# Altium schematic sheet main.schdoc
size A4; SheetNumber: 1; SheetTotal: 1
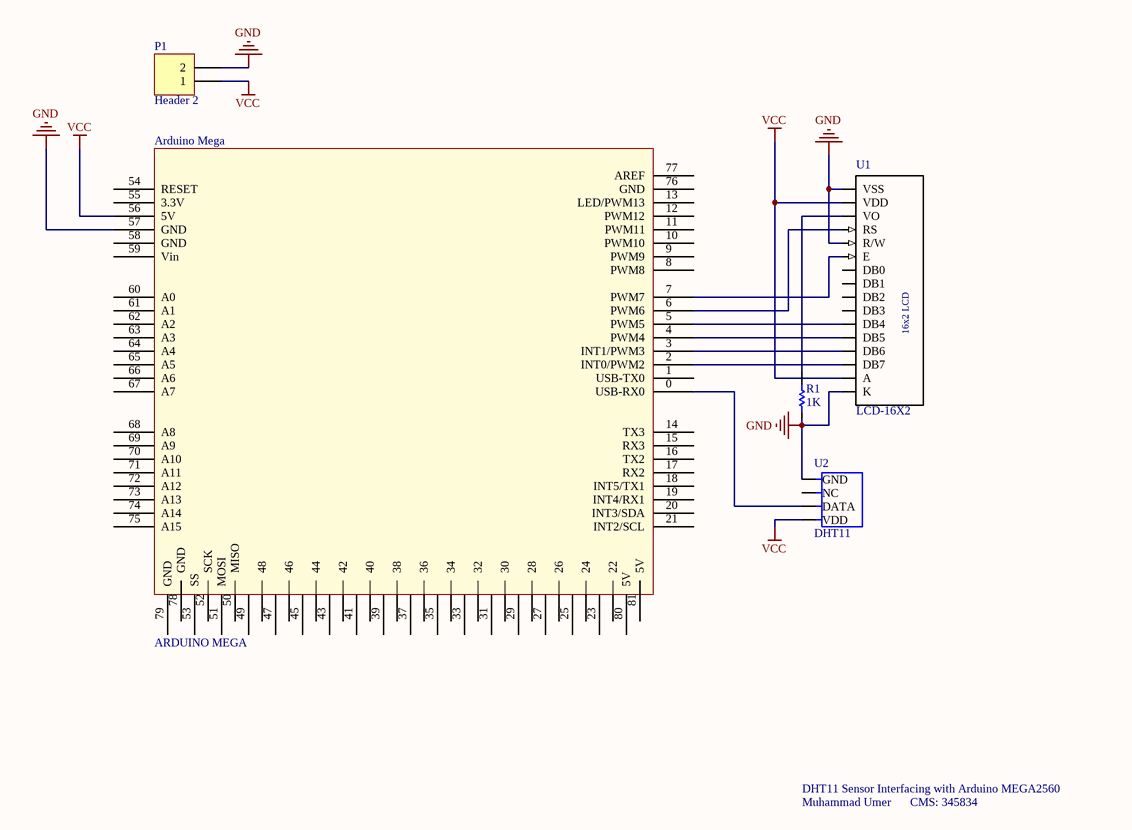
[diagram p0: main.schdoc]

## Parts
Arduino_Mega  ARDUINO MEGA  [ARDUINO MEGA]
P1  Header 2  [HDR1X2]
R1  value 1K  (hidden comment: Resistor)
U1  LCD-16X2  [*LCD-16X2]
U2  DHT11  [SNR4-2.54-15.5X12.0X5.5MM]

## Nets
GND: Arduino_Mega.57(GND) P1.2 R1.1 U1.1(VSS) U1.5(R/W) U1.16(K) U2.4(GND)
VCC: Arduino_Mega.56(5V) P1.1 U1.2(VDD) U1.15(A) U2.1(VDD)
NetArduino_Mega_0: Arduino_Mega.0(USB-RX0) U2.2(DATA)
NetArduino_Mega_2: Arduino_Mega.2(INT0/PWM2) U1.14(DB7)
NetArduino_Mega_3: Arduino_Mega.3(INT1/PWM3) U1.13(DB6)
NetArduino_Mega_4: Arduino_Mega.4(PWM4) U1.12(DB5)
NetArduino_Mega_5: Arduino_Mega.5(PWM5) U1.11(DB4)
NetArduino_Mega_6: Arduino_Mega.6(PWM6) U1.4(RS)
NetArduino_Mega_7: Arduino_Mega.7(PWM7) U1.6(E)
NetR1_2: R1.2 U1.3(VO)

Not connected (* = marked no-connect by the designer): Arduino_Mega 1(USB-TX0) 8(PWM8) 9(PWM9) 10(PWM10) 11(PWM11) 12(PWM12) 13(LED/PWM13) 14(TX3) 15(RX3) 16(TX2) 17(RX2) 18(INT5/TX1) 19(INT4/RX1) 20(INT3/SDA) 21(INT2/SCL) 22 23 24 25 26 27 28 29 30 31 32 33 34 35 36 37 38 39 40 41 42 43 44 45 46 47 48 49 50(MISO) 51(MOSI) 52(SCK) 53(SS) 54(RESET) 55(3.3V) 58(GND) 59(Vin) 60(A0) 61(A1) 62(A2) 63(A3) 64(A4) 65(A5) 66(A6) 67(A7) 68(A8) 69(A9) 70(A10) 71(A11) 72(A12) 73(A13) 74(A14) 75(A15) 76(GND) 77(AREF) 78(GND) 79(GND) 80(5V) 81(5V); U1 7(DB0) 8(DB1) 9(DB2) 10(DB3); U2 3(NC)

## Notes on the sheet
- Muhammad Umer
- DHT11 Sensor Interfacing with Arduino MEGA2560
- CMS: 345834
- (in symbol LCD-16X2) 16x2 LCD

## Library data of the parts
P1 = Header 2: Header, 2-Pin; LatestRevisionDate: 17-Jul-2002; LatestRevisionNote: Re-released for DXP Platform.; Publisher: Altium Limited
R1 = Resistor: TC1: 0; SimulationGenericComponent: True; TC2: 0
U1 = LCD-16X2: Display Development Tools 16x2 Black on Green Char LCD w Backlight; MF: Gravitech; Package: None; SnapEDA_Link: https://www.snapeda.com/parts/LCD-16X2/Gravitech/view-part/?ref=snap; MP: LCD-16X2; Availability: In Stock; Price: None; Purchase-URL: https://pricing.snapeda.com/search/part/LCD-16X2/?ref=eda; Check_prices: https://www.snapeda.com/parts/LCD-16X2/Gravitech/view-part/?ref=eda; Value: *
U2 = TEM-HUM-DHT11(4P-15.5X12.0MM): Servo AC 100 ~ 120VAC Supply 10A 120V Load; MF: Panasonic Industrial Automation Sales; MP: DHT11; Package: None; SnapEDA_Link: https://www.snapeda.com/parts/DHT11/Panasonic/view-part/6618018/?ref=snap; Check_prices: https://www.snapeda.com/parts/DHT11/Panasonic/view-part/6618018/?ref=eda; Availability: In Stock; Value: *; Price: None; Purchase-URL: https://pricing.snapeda.com/search/part/DHT11/?ref=eda